# Altium schematic sheet 行天宮-流亡暗道-石像.SchDoc
size A3
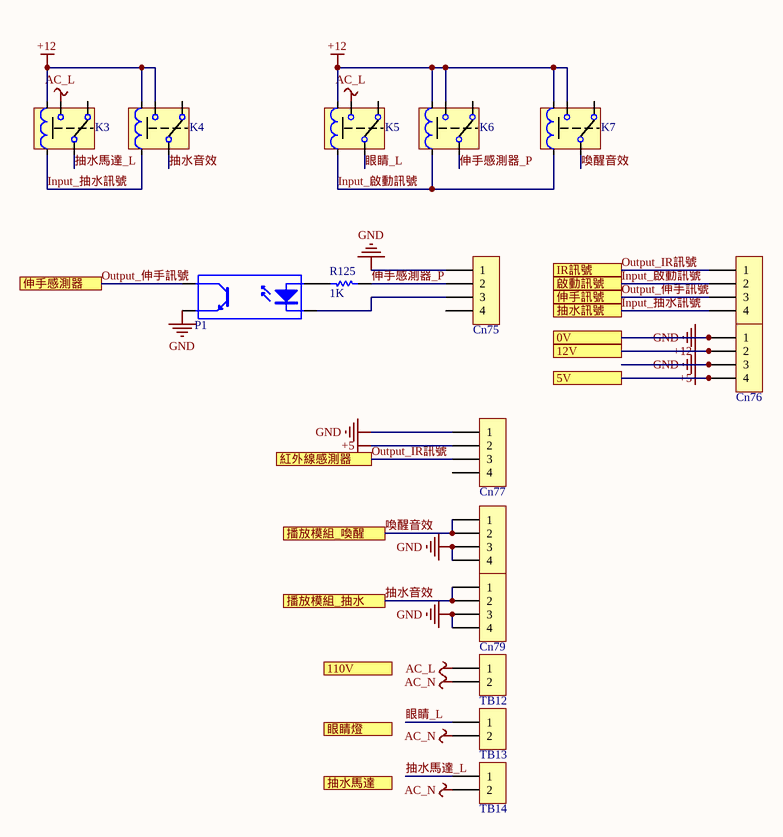
[diagram p0: 行天宮-流亡暗道-石像.SchDoc]

## Parts
Cn74  KF2510-4  [Connector_KF2510-4W]  (value not drawn)
Cn75  KF2510-4  [Connector_KF2510-4W]  (value not drawn)
Cn76  KF2510-4  [Connector_KF2510-4W]  (value not drawn)
Cn77  KF2510-4  [Connector_KF2510-4W]  (value not drawn)
Cn78  KF2510-4  [Connector_KF2510-4W]  (value not drawn)
Cn79  KF2510-4  [Connector_KF2510-4W]  (value not drawn)
K3  G2R-1-24VDC  [RELAY-HF41F-012-ZST]  (value not drawn)
K4  G2R-1-24VDC  [RELAY-HF41F-012-ZST]  (value not drawn)
K5  G2R-1-24VDC  [RELAY-HF41F-012-ZST]  (value not drawn)
K6  G2R-1-24VDC  [RELAY-HF41F-012-ZST]  (value not drawn)
K7  G2R-1-24VDC  [RELAY-HF41F-012-ZST]  (value not drawn)
P1  PC817  [PC817]  (value not drawn)
R125  1K  [Res_1/4]
TB12  ZB25(2P)  [Terminal block(KF2EDGR-5.08 _2P)]  (value not drawn)
TB13  ZB25(2P)  [Terminal block(KF2EDGR-5.08 _2P)]  (value not drawn)
TB14  ZB25(2P)  [Terminal block(KF2EDGR-5.08 _2P)]  (value not drawn)

## Ports
0V, 5V, 12V, 110V, IR訊號, 伸手感測器, 伸手訊號, 啟動訊號, 抽水訊號, 抽水馬達, 播放模組_喚醒, 播放模組_抽水, 眼睛燈, 紅外線感測器

## Nets
+5: Cn76.4 Cn77.2 ; port 5V
+12: Cn76.2 K3.5(A2) K4.2(NO) K4.5(A2) K5.5(A2) K6.2(NO) K6.5(A2) K7.2(NO) K7.5(A2) ; port 12V
AC_L: K3.2(NO) K5.2(NO) TB12.1
AC_N: TB12.2 TB13.2 TB14.2
GND: Cn75.1 Cn76.1 Cn76.3 Cn77.1 Cn78.3 Cn78.4 Cn79.3 Cn79.4 P1.3(E) ; port 0V
Input_啟動訊號: Cn74.2 K5.4(A1) K6.4(A1) K7.4(A1) ; port 啟動訊號
Input_抽水訊號: Cn74.4 K3.4(A1) K4.4(A1) ; port 抽水訊號
Output_IR訊號: Cn74.1 Cn77.3 ; port IR訊號, port 紅外線感測器
Output_伸手訊號: Cn74.3 P1.4(C) ; port 伸手訊號, port 伸手感測器
伸手感測器_P: Cn75.2 K6.1(COM) R125.2
喚醒音效: Cn78.1 Cn78.2 K7.1(COM) ; port 播放模組_喚醒
抽水音效: Cn79.1 Cn79.2 K4.1(COM) ; port 播放模組_抽水
抽水馬達_L: K3.1(COM) TB14.1
眼睛_L: K5.1(COM) TB13.1
NetCn75_3: Cn75.3 P1.2(K)
NetP1_1: P1.1(A) R125.1

Not connected (* = marked no-connect by the designer): Cn75 4; Cn77 4; K3 3(NC); K4 3(NC); K5 3(NC); K6 3(NC); K7 3(NC)

## Library data of the parts
Cn74-Cn79 = Contact(4P): 接線端子
K3-K7 = Relay: 繼電器
P1 = PC817: 光耦
R125 = Res: 電阻
TB12-TB14 = Terminal block(2P): 端子台